# EAGLE design Datalog Board1 (EAGLE 6.5.0)
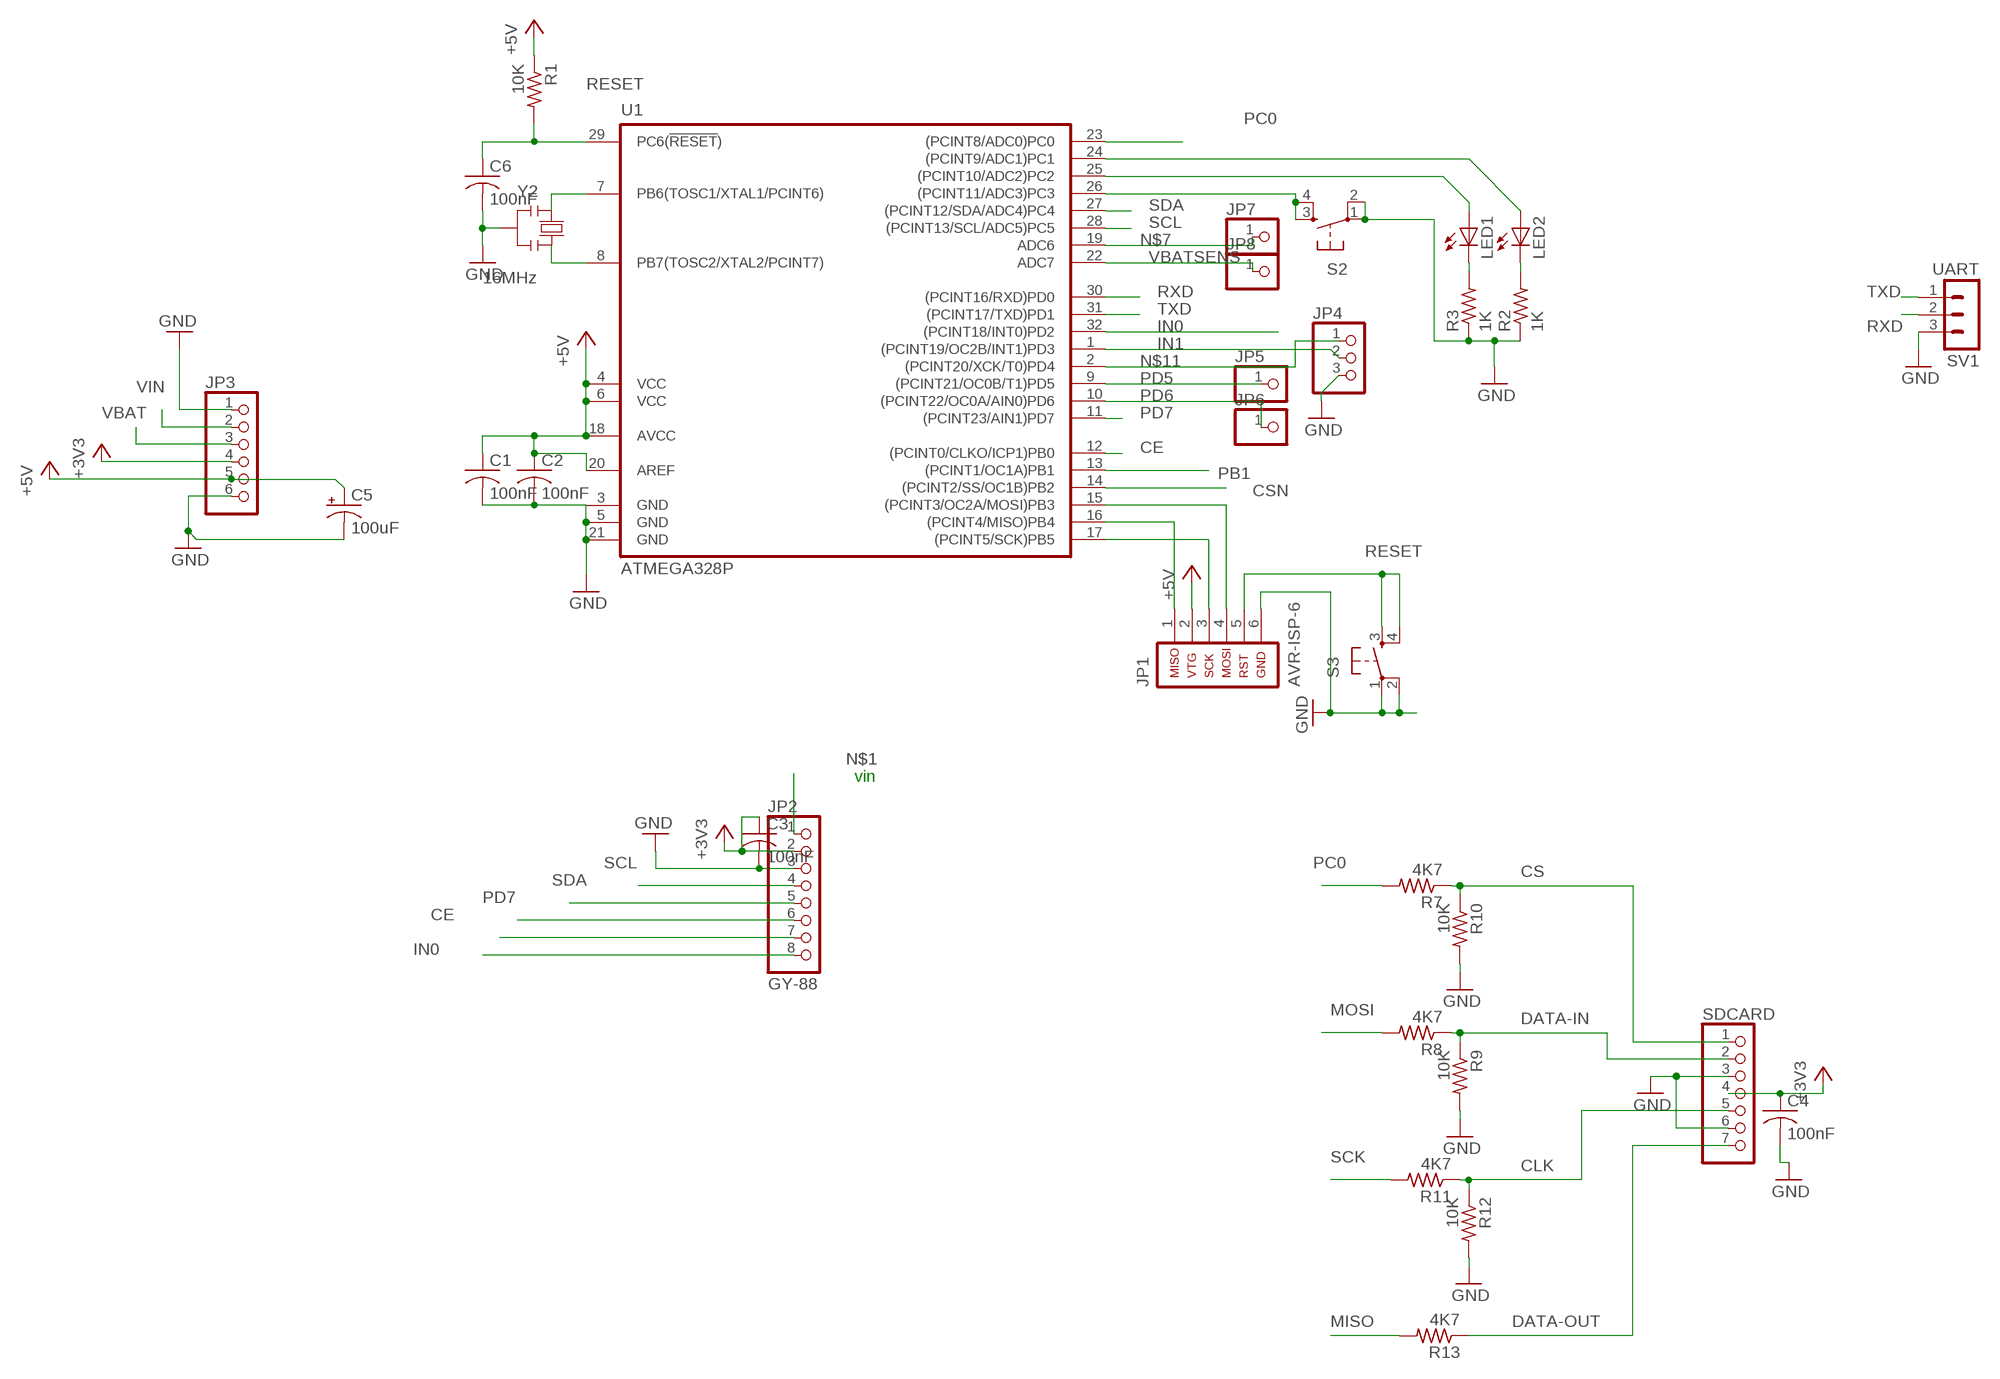
[diagram p0: schematic, sheet 1]

## Parts
C1  100nF  C-USC0805K  [C0805K]
C2  100nF  C-USC0805K  [C0805K]
C3  100nF  C-USC0805K  [C0805K]
C4  100nF  C-USC0805K  [C0805K]
C5  100uF  CPOL-USD  [PANASONIC_D]
C6  100nF  C-USC0805K  [C0805K]
JP1  AVR-ISP-6  [AVR-ISP-6]
JP2  GY-88  PINHD-1X8  [1X08]
JP3  PINHD-1X6  [1X06]
JP4  PINHD-1X3  [1X03]
JP5  PINHD-1X1  [1X01]
JP6  PINHD-1X1  [1X01]
JP7  PINHD-1X1  [1X01]
JP8  PINHD-1X1  [1X01]
LED1  LEDCHIPLED_0805  [CHIPLED_0805]
LED2  LEDCHIPLED_0805  [CHIPLED_0805]
R1  10K  R-US_R0805  [R0805]
R2  1K  R-US_R0805  [R0805]
R3  1K  R-US_R0805  [R0805]
R7  4K7  R-US_R0805  [R0805]
R8  4K7  R-US_R0805  [R0805]
R9  10K  R-US_R0805  [R0805]
R10  10K  R-US_R0805  [R0805]
R11  4K7  R-US_R0805  [R0805]
R12  10K  R-US_R0805  [R0805]
R13  4K7  R-US_R0805  [R0805]
S2  TAC_SWITCHSMD  [TACTILE_SWITCH_SMD]
S3  TAC_SWITCHSMD  [TACTILE_SWITCH_SMD]
SDCARD  PINHD-1X7  [1X07]
SV1  UART  MA03-1  [MA03-1]
U1  ATMEGA328P  ATMEGA48P/88P/168P/328P-A  [TQFP32A]
Y2  16MHz  RESONATORMU  [RESONATOR]

## Nets
+3V3: C3.1 C4.1 JP2.2 JP3.4 SDCARD.4
+5V: C1.1 C2.1 C5.+ JP1.2 JP3.5 R1.1 U1.4(VCC) U1.6(VCC) U1.18(AVCC) U1.20(AREF)
CE: JP2.7 U1.12((PCINT0/CLKO/ICP1)PB0)
CLK: R11.1 R12.1 SDCARD.5
CS: R7.1 R10.1 SDCARD.1
CSN: U1.14((PCINT2/SS/OC1B)PB2)
DATA-IN: R8.1 R9.1 SDCARD.2
DATA-OUT: R13.1 SDCARD.7
GND: C1.2 C2.2 C3.2 C4.2 C5.- C6.2 JP1.6 JP2.3 JP3.1 JP3.6 JP4.3 R2.1 R3.1 R9.2 R10.2 R12.2 S2.1 S2.2 S3.1 S3.2 SDCARD.3 SDCARD.6 SV1.3 U1.5(GND) U1.21(GND) Y2.2
IN0: JP2.8 U1.32((PCINT18/INT0)PD2)
IN1: JP4.2 U1.1((PCINT19/OC2B/INT1)PD3)
MISO: JP1.1 R13.2 U1.16((PCINT4/MISO)PB4)
MOSI: JP1.4 R8.2 U1.15((PCINT3/OC2A/MOSI)PB3)
N$1: JP2.1
N$2: LED2.A U1.24((PCINT9/ADC1)PC1)
N$3: LED1.A U1.25((PCINT10/ADC2)PC2)
N$4: S2.3 S2.4 U1.26((PCINT11/ADC3)PC3)
N$7: JP7.1 U1.19(ADC6)
N$9: U1.8(PB7(TOSC2/XTAL2/PCINT7)) Y2.3
N$10: U1.7(PB6(TOSC1/XTAL1/PCINT6)) Y2.1
N$11: JP4.1 U1.2((PCINT20/XCK/T0)PD4)
N$12: LED2.C R2.2
N$13: LED1.C R3.2
PB1: U1.13((PCINT1/OC1A)PB1)
PC0: R7.2 U1.23((PCINT8/ADC0)PC0)
PD5: JP5.1 U1.9((PCINT21/OC0B/T1)PD5)
PD6: JP6.1 U1.10((PCINT22/OC0A/AIN0)PD6)
PD7: JP2.6 U1.11((PCINT23/AIN1)PD7)
RESET: C6.1 JP1.5 R1.2 S3.3 S3.4 U1.29(PC6(!RESET!))
RXD: SV1.2 U1.30((PCINT16/RXD)PD0)
SCK: JP1.3 R11.2 U1.17((PCINT5/SCK)PB5)
SCL: JP2.4 U1.28((PCINT13/SCL/ADC5)PC5)
SDA: JP2.5 U1.27((PCINT12/SDA/ADC4)PC4)
TXD: SV1.1 U1.31((PCINT17/TXD)PD1)
VBAT: JP3.3
VBATSENS: JP8.1 U1.22(ADC7)
VIN: JP3.2

## Notes on the sheet
- vin

## Power pins joined to a net without a drawn wire
GND: U1.3(GND)

## Library data of the parts
C1-C4 C6 = resistor:C-US: CAPACITOR, American symbol
C5 = resistor:CPOL-US: POLARIZED CAPACITOR, American symbol
JP1 = atmel:AVR-ISP-6: AVR ISP-6 Serial Programming Header
JP2 = pinhead:PINHD-1X8: PIN HEADER
JP3 = pinhead:PINHD-1X6: PIN HEADER
JP4 = pinhead:PINHD-1X3: PIN HEADER
JP5-JP8 = pinhead:PINHD-1X1: PIN HEADER
LED1 LED2 = led:LED: LED OSRAM: - CHIPLED LG R971, LG N971, LY N971, LG Q971, LY Q971, LO R971, LY R971 LH N974, LH R974 LS Q976, LO Q976, LY Q976 LO Q996 - Hyper CHIPLED LW Q18S LB Q993, LB Q99A, LB R99A - SideLED LS A670, LO A670, LY A670, LG A670, LP A670 LB A673, LV A673, LT A673, LW A673 LH A674 LY A675 LS A676, LA A676, LO A676, LY A676, LW A676 LS A679, LY A679, LG A679 - Hyper Micro SIDELED® LS Y876, LA Y876, LO Y876, LY Y876 LT Y87S - SmartLED LW L88C, LW L88S LB L89C, LB L89S, LG L890 LS L89K, LO L89K, LY L89K LS L896, LA L896, LO L896, LY L896 - TOPLED LS T670, LO T670, LY T670, LG T670, LP T670 LSG T670, LSP T670, LSY T670, LOP T670, LYG T670 LG T671, LOG T671, LSG T671 LB T673, LV T673, LT T673, LW T673 LH T674 LS T676, LA T676, LO T676, LY T676, LB T676, LH T676, LSB T676, LW T676 LB T67C, LV T67C, LT T67C, LS T67K, LO T67K, LY T67K, LW E67C LS E67B, LA E67B, LO E67B, LY E67B, LB E67C, LV E67C, LT E67C LW T67C LS T679, LY T679, LG T679 LS T770, LO T770, LY T770, LG T770, LP T770 LB T773, LV T773, LT T773, LW T773 LH T774 LS E675, LA E675, LY E675, LS T675 LS T776, LA T776, LO T776, LY T776, LB T776 LHGB T686 LT T68C, LB T68C - Hyper Mini TOPLED® LB M676 - Mini TOPLED Santana® LG M470 LS M47K, LO M47K, LY M47K Source: http://www.osram.convergy.de LUXEON: - LUMILED® LXK2-PW12-R00, LXK2-PW12-S00, LXK2-PW14-U00, LXK2-PW14-V00 LXK2-PM12-R00, LXK2-PM12-S00, LXK2-PM14-U00 LXK2-PE12-Q00, LXK2-PE12-R00, LXK2-PE12-S00, LXK2-PE14-T00, LXK2-PE14-U00 LXK2-PB12-K00, LXK2-PB12-L00, LXK2-PB12-M00, LXK2-PB14-N00, LXK2-PB14-P00, LXK2-PB14-Q00 LXK2-PR12-L00, LXK2-PR12-M00, LXK2-PR14-Q00, LXK2-PR14-R00 LXK2-PD12-Q00, LXK2-PD12-R00, LXK2-PD12-S00 LXK2-PH12-R00, LXK2-PH12-S00 LXK2-PL12-P00, LXK2-PL12-Q00, LXK2-PL12-R00 Source: www.luxeon.com KINGBRIGHT: KA-3528ASYC Source: www.kingbright.com
R1-R3 R7-R13 = resistor:R-US_: RESISTOR, American symbol
S2 S3 = SparkFun:TAC_SWITCH: Momentary Switch Button commonly used for reset or general input. Spark Fun Electronics SKU : COM-00097
SDCARD = pinhead:PINHD-1X7: PIN HEADER
SV1 = con-lstb:MA03-1: PIN HEADER; OC_FARNELL: unknown; OC_NEWARK: unknown
U1 = atmel-avr:ATMEGA48P/88P/168P/328P: MICROCONTROLLER 4/8/16/32K Flash
Y2 = SmartPrj:RESONATOR

## Net classes
0 default: width 0.152 mm, drill 0.305 mm, clearance 0.152 mm

## Board
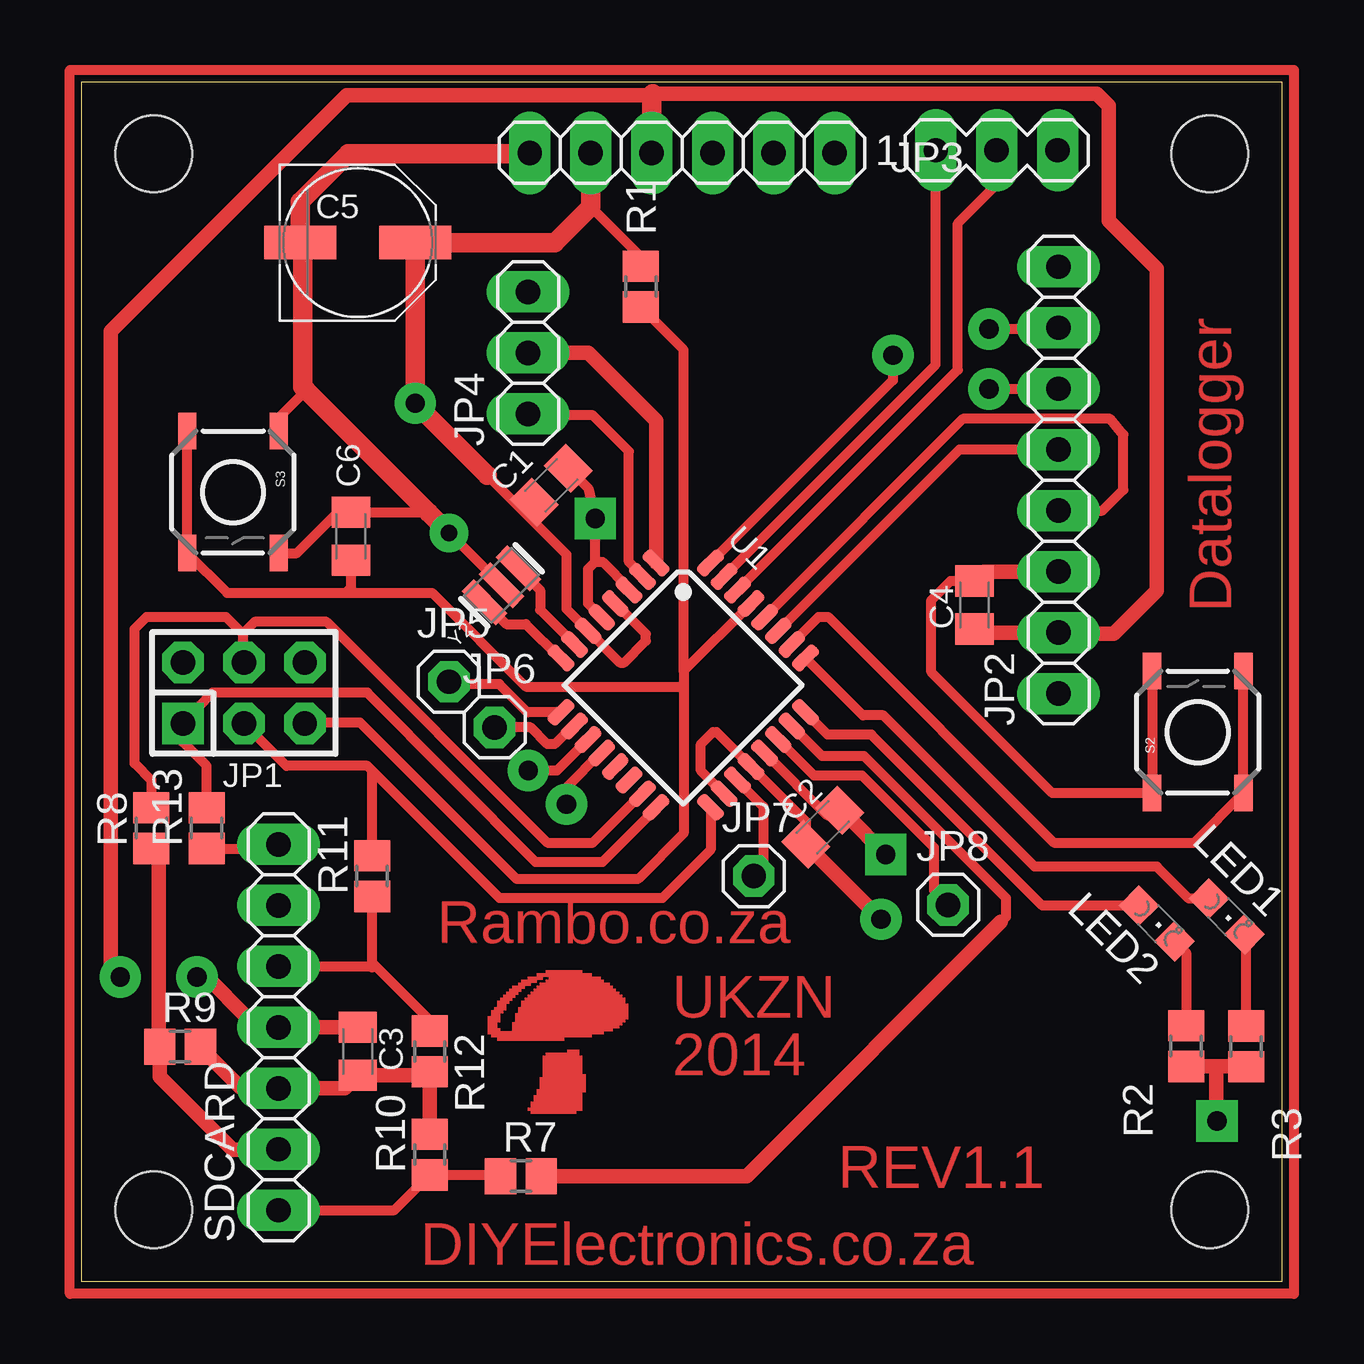
[diagram p1: board, top side]
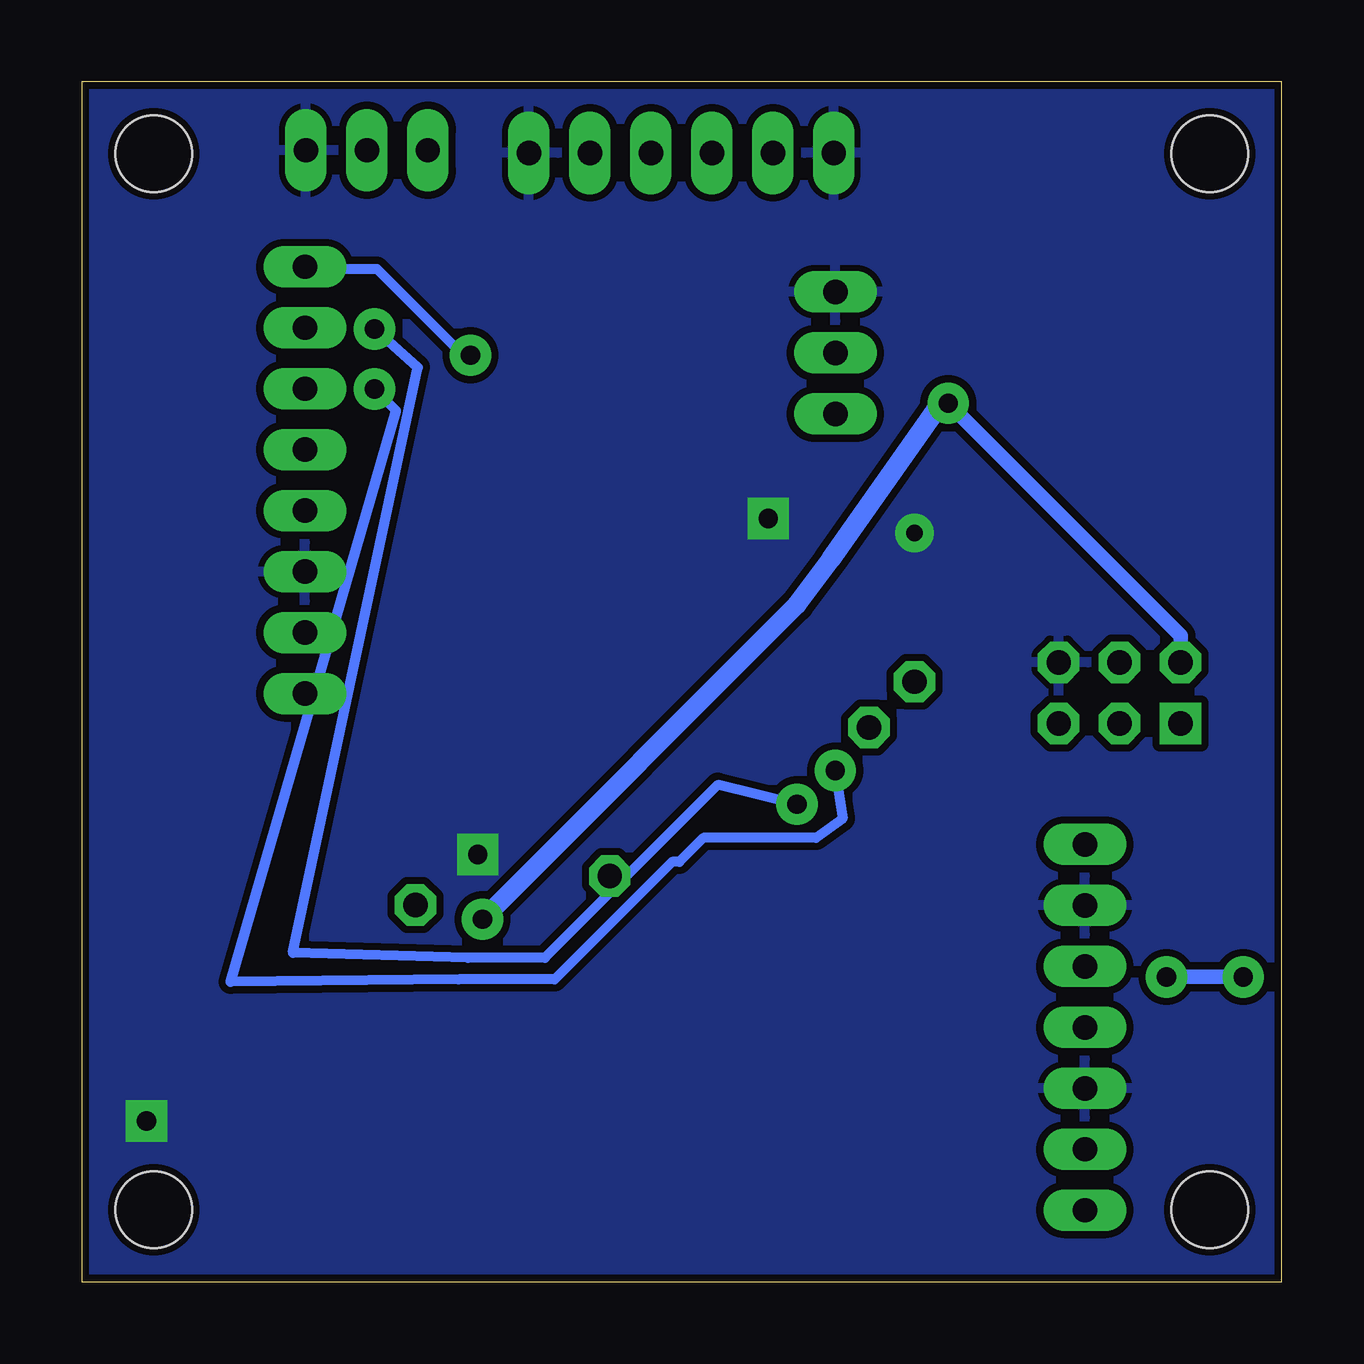
[diagram p2: board, bottom side, seen from below]

Size 50 x 50 mm. Coordinates in mm from the lower left corner, seen from the top.
Outline: 0,0 0,50 50,50 50,0 0,0
Copper layers (1*16): Top 0.035mm / dielectric 1.5mm / Bottom 0.035mm
Design rules "SparkFun *": minimum track width 8mil, minimum drill 20mil, track to track 8mil, track to pad 8mil, pad to pad 8mil, via to via 8mil, smd to smd 8mil, copper to edge 10mil, drill to drill 8mil, minimum pad ring 14mil, minimum via ring 18mil, stop-mask expansion 4mil, vias tented up to drill 25mil, thermal gap 10mil
Holes 3.2 mm at 3,3 3,47 47,47 47,3

### Footprints (pad centres in the part's own frame; a part is rotated, then mirrored left to right if it is on the bottom)
C0805K = smd 1.3 x 1.6: 1 -1,0; 2 1,0
PANASONIC_D = smd 3 x 1.4: + 2.4,0; - -2.4,0
AVR-ISP-6 = drill 1.016 square: 1 -2.54,-1.27 | drill 1.016 octagon: 2 -2.54,1.27; 3 0,-1.27; 4 0,1.27; 5 2.54,-1.27; 6 2.54,1.27
1X08 = drill 1.016 long: 1 -8.89,0; 2 -6.35,0; 3 -3.81,0; 4 -1.27,0; 5 1.27,0; 6 3.81,0; 7 6.35,0; 8 8.89,0
1X06 = drill 1.016 long: 1 -6.35,0; 2 -3.81,0; 3 -1.27,0; 4 1.27,0; 5 3.81,0; 6 6.35,0
1X03 = drill 1.016 long: 1 -2.54,0; 2 0,0; 3 2.54,0
1X01 = drill 1.016 octagon: 1 0,0
CHIPLED_0805 = smd 1.2 x 1.2: A 0,-1.05; C 0,1.05
R0805 = smd 1.3 x 1.5: 1 -0.85,0; 2 0.85,0
TACTILE_SWITCH_SMD = smd 1.524 x 0.762: 1 -2.54,1.905; 2 2.54,1.905; 3 -2.54,-1.905; 4 2.54,-1.905
1X07 = drill 1.016 long: 1 -7.62,0; 2 -5.08,0; 3 -2.54,0; 4 0,0; 5 2.54,0; 6 5.08,0; 7 7.62,0
MA03-1 = drill 1.016 long: 1 -2.54,0; 2 0,0; 3 2.54,0
TQFP32A = smd 1.27 x 0.559: 1 -4.4,2.8; 2 -4.4,2; 3 -4.4,1.2; 4 -4.4,0.4; 5 -4.4,-0.4; 6 -4.4,-1.2; 7 -4.4,-2; 8 -4.4,-2.8; 17 4.4,-2.8; 18 4.4,-2; 19 4.4,-1.2; 20 4.4,-0.4; 21 4.4,0.4; 22 4.4,1.2; 23 4.4,2; 24 4.4,2.8 | smd 0.559 x 1.27: 9 -2.8,-4.4; 10 -2,-4.4; 11 -1.2,-4.4; 12 -0.4,-4.4; 13 0.4,-4.4; 14 1.2,-4.4; 15 2,-4.4; 16 2.8,-4.4; 25 2.8,4.4; 26 2,4.4; 27 1.2,4.4; 28 0.4,4.4; 29 -0.4,4.4; 30 -1.2,4.4; 31 -2,4.4; 32 -2.8,4.4
RESONATOR = smd 0.7 x 2: 1 -1,0; 2 0,0; 3 1,0

### Placement (x,y rotation side)
C1  19.56,33.19 45 top
C2  30.88,18.93 45 top
C3  11.5,9.6 270 top
C4  37.2,28.2 90 top
C5  11.5,43.3 0 top
C6  11.21,31.06 90 top
JP1  6.75,24.54 0 top
JP2  40.7,33.4 90 top
JP3  25.02,47.04 180 top
JP4  18.6,38.7 90 top
JP5  15.3,25 0 top
JP6  17.2,23.1 0 top
JP7  28,16.9 0 top
JP8  36.1,15.7 0 top
LED1  47.71,15.22 225 top
LED2  44.79,14.93 225 top
R1  23.29,41.47 270 top
R2  46.01,9.82 90 top
R3  48.52,9.81 90 top
R7  18.3,4.4 0 top
R8  2.9,18.9 90 top
R9  4.1,9.8 0 top
R10  14.5,5.3 90 top
R11  12.1,16.9 90 top
R12  14.5,9.6 270 top
R13  5.2,18.9 90 top
S2  46.5,22.9 90 top
S3  6.3,32.9 270 top
SDCARD  8.2,10.6 90 top
SV1  38.12,47.15 0 top
U1  25.06,24.86 315 top
Y2  17.49,29.02 225 top

### Tracks (layer width: path | path; a pad name or v marks a point on that pad's centre or on a via)
+3V3  (via drill 0.8)
  Top 0.61: C3.1 SDCARD.4 7.8,11 6.9,11 5.2,12.7 v4.8,12.7 | 23.8,49.5 42.3,49.5 42.8,49 42.8,44.2 44.8,42.2 44.8,28.8 43,27 40.75,27 JP2.2 37.35,27.05 C4.1 | 23.75,49.45 11.04,49.45 1.2,39.6 1.2,13.1 v1.6,12.7
  Top 0.813: JP3.4 23.75,49.45 23.8,49.5
  Bottom 0.61: v1.6,12.7 v4.8,12.7
+5V  (via drill 0.8)
  Top 0.406: C2.1 30.17,19.19 U1.20 26.45,22.9 26.3,22.9 25.8,22.4 25.8,21.3 26.76,20.34 U1.18 | R1.1 23.3,42.7 21.2,44.8 | U1.4 22.25,28.25 23.5,27 23.5,26.7 22.6,25.8 22.42,25.8 U1.6 20.2,28.02 20.2,30.3 18.3,32.2 | 18.3,32.2 16.9,33.6 | C1.1 18.57,32.2 18.3,32.2
  Top 0.61: v33.3,15.1 C2.1
  Top 0.813: JP3.5 21.2,44.8 19.7,43.3 C5.+ v13.9,36.6 16.9,33.6
  Bottom 0.61: JP1.2 4.21,26.91 v13.9,36.6
  Bottom 0.813: v13.9,36.6 14.2,36.6 18.8,30.1 20.2,28.2 v33.3,15.1
CE  (via drill 0.8)
  Top 0.406: U1.12 21.63,22.03 20.2,20.6 v20.2,19.9 | v37.8,39.7 40.65,39.7 JP2.7
  Bottom 0.406: v20.2,19.9 23.5,20.7 30.7,13.5 33.9,13.5 41.2,13.7 36,38.1 v37.8,39.7
CLK
  Top 0.406: SDCARD.5 12.06,13.14 12.1,13.1 12.1,13.3 | 12.1,13.3 R11.1 | R12.1 14.5,10.9 12.1,13.3
CS
  Top 0.406: SDCARD.1 13.03,2.98 R10.1 17.4,4.45 R7.1
DATA-IN
  Top 0.61: SDCARD.2 8.18,5.5 6.3,5.5 3.25,8.55 R9.1 3.2,9.85 3.2,17.75 R8.1
DATA-OUT
  Top 0.406: R13.1 8.03,18.05 SDCARD.7
GND  (via drill 0.7, 0.8)
  Top 0.406: U1.21 31.04,19.44 31.89,19.44 32.15,19.44 31.95,19.64 C2.2 | Y2.2 v15.31,31.2 v15.3,31.2 | S3.1 8.21,36.01 9.35,37.15 | S2.2 S2.1 40.44,20.36 35.4,25.4 35.4,28.4 36.2,29.2 C4.2 | C4.2 37.4,29.2 37.8,28.8 37.6,28.8 C4.2 | U1.5 21.1,28.25 21.1,29.7 21.4,30 | 21.4,30 21.7,30 22.8,28.9 U1.3 | C1.2 21.1,33.07 v21.4,31.8 21.4,30 | S3.2 8.96,30.36 10.7,32.1 11.18,32.1 C6.2 14.44,32.06 14.45,32.05
  Top 0.61: R9.2 4.95,9.75 6.6,8.1 8.16,8.1 SDCARD.3 10.96,8.06 C3.2 14.35,8.6 R12.2 R10.2 | JP2.3 37.59,29.59 C4.2 | 31.89,19.44 31.89,19.41 v33.5,17.8 | R2.1 47.26,8.97 | 47.26,8.97 48.5,8.97 R3.1 | 47.26,8.97 47.26,6.74 v47.3,6.7
  Top 0.813: C5.- 9.1,43.5 | 9.1,43.5 9.1,45 11.1,47 18.63,47 JP3.6 | v15.3,31.2 14.45,32.05 9.35,37.15 9.2,37.3 9.2,43.4 9.1,43.5
  Bottom 0.406: v15.3,31.2 15.5,31.4 15.6,31.4 | 21.4,32 v21.4,31.8 21.4,31.6
  Bottom 0.61: v33.5,17.8 33.7,17.8 | v47.3,6.7 47.4,6.6
  pour Bottom (isolate 0.305): 0,50 0,0 50,0 50,50
IN0  (via drill 0.8)
  Top 0.406: v33.8,38.6 33.8,37.56 U1.32
  Bottom 0.406: JP2.8 40.61,42.2 37.7,42.2 34.1,38.6 v33.8,38.6
IN1
  Top 0.61: U1.1 23.93,35.87 21.1,38.7 JP4.2
MISO
  Top 0.406: U1.16 23.93,19.73 21.7,17.5 18.9,17.5 11.9,24.55 5.45,24.55 JP1.1 4.2,23.25 4.2,22.5 5.2,21.5 R13.2
MOSI
  Top 0.406: U1.15 23.34,20.34 21.3,18.3 19.4,18.3 10.2,27.5 7.2,27.5 6.7,27 | 6.7,27 6.7,25.86 JP1.4 | 6.7,27 6,27.7 2.7,27.7 2.2,27.2 2.2,21.6 2.9,20.9 R8.2
N$2
  Top 0.406: LED2.A 40.02,15.68 32.9,22.8 31.08,22.8 U1.24
N$3
  Top 0.406: LED1.A 46.13,15.97 44.8,17.3 39.7,17.3 33.4,23.6 32.54,23.6 U1.25
N$4
  Top 0.406: U1.26 29.59,26.59 30.7,27.7 31.1,27.7 40.5,18.3 46.34,18.3 S2.3 S2.4
N$5
  Top 0.406: -0.5,-0.5 -0.5,50.5 50.5,50.5 50.5,-0.5 -0.5,-0.5
N$7
  Top 0.406: U1.19 27.32,20.88 28.4,19.8 28.4,17.3 JP7.1
N$9
  Top 0.406: Y2.3 17.69,27.4 18.5,27.4 19.91,25.99 U1.8
N$10
  Top 0.406: Y2.1 19.1,28.82 19.1,28 U1.7
N$11
  Top 0.406: U1.2 23.36,29.44 22.8,30 22.8,34.6 21.3,36.1 18.66,36.1 JP4.1
N$12
  Top 0.406: LED2.C 46.01,13.71 R2.2
N$13
  Top 0.406: R3.2 48.52,14.41 LED1.C
PC0
  Top 0.406: U1.23 30.85,21.9 32.6,21.9 38.5,16 38.5,15.2 38.3,15
  Top 0.61: R7.2 27.7,4.4 38.3,15
PD5
  Top 0.406: U1.9 18.57,23.73 17.4,24.9 15.4,24.9 JP5.1
PD6
  Top 0.406: U1.10 20.46,23.16 19.7,22.4 19.4,22.4 18.7,23.1 JP6.1
PD7  (via drill 0.8)
  Top 0.406: U1.11 19.8,21.3 v18.6,21.3 | v37.8,37.2 JP2.6
  Bottom 0.406: v18.6,21.3 18.3,19.3 19.4,18.5 24.1,18.5 25.1,17.5 25.4,17.5 30.3,12.6 34.3,12.6 43.8,12.5 36.9,36.3 v37.8,37.2
RESET
  Top 0.406: U1.29 25.08,25.45 | 25.08,25.45 25.08,24.9 | 25.08,24.9 25.08,18.68 23.2,16.8 18.1,16.8 11.6,23.3 9.32,23.3 JP1.5 | 25.08,25.45 25.08,38.83 R1.2 | S3.3 S3.4 6.05,28.7 11,28.7 | 25.08,24.9 24.98,24.8 18.5,24.8 14.6,28.7 11,28.7 | C6.1 11.21,28.91 11,28.7
RXD
  Top 0.406: U1.30 36.5,38 36.5,44.1 38.12,45.72 SV1.2
SCK
  Top 0.406: U1.17 26.2,19.77 26.2,18 24.2,16 17.4,16 12.1,21.3 | JP1.3 8.52,21.5 11.9,21.5 12.1,21.3 | R11.2 12.1,21.3
SCL
  Top 0.406: U1.28 36.72,35.95 42.85,35.95 43.4,35.3 43.4,33 42.53,32.13 JP2.4
SDA
  Top 0.406: JP2.5 36.57,34.67 U1.27
TXD
  Top 0.406: U1.31 35.58,38.21 SV1.1
VBATSENS
  Top 0.406: U1.22 29.02,22.58 30.5,21.1 32.5,21.1 35.5,18.1 35.5,16.3 JP8.1
(copper drawn outside any net)
  shapes: Top area x62, Top circle x4

### Text on the board
Top: Datalogger | Rambo.co.za | UKZN | 2014 | REV1.1 | DIYElectronics.co.za
tValues: Tx | Rx | Gnd